# Altium schematic sheet ADF4351.SchDoc
size A4
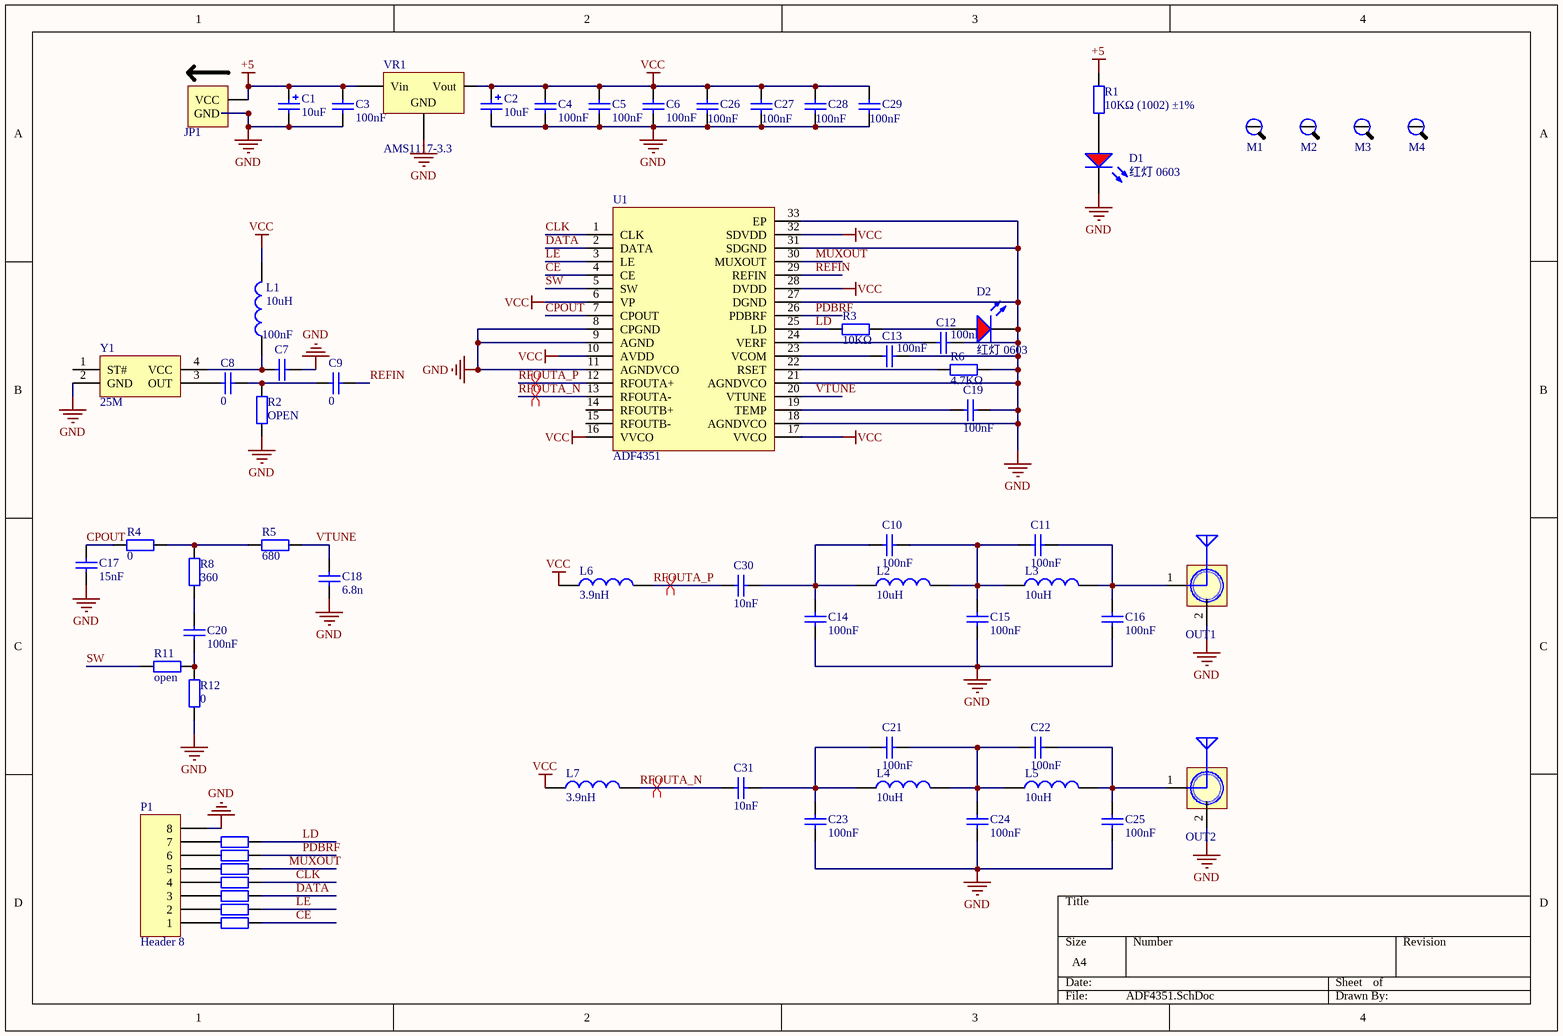
[diagram p0: ADF4351.SchDoc]

## Parts
C1  10uF  [CASE-A_3216]
C2  10uF  [CASE-A_3216]
C3  100nF  [0603_C]
C4  100nF  [0603_C]
C5  100nF  [0603_C]
C6  100nF  [0603_C]
C7  100nF  [0603_C]
C8  0  [0603_C]
C9  0  [0603_C]
C10  100nF  [0603_C]
C11  100nF  [0603_C]
C12  100nF  [0603_C]
C13  100nF  [0603_C]
C14  100nF  [0603_C]
C15  100nF  [0603_C]
C16  100nF  [0603_C]
C17  15nF  [0603_C]
C18  6.8n  [0603_C]
C19  100nF  [0603_C]
C20  100nF  [0603_C]
C21  100nF  [0603_C]
C22  100nF  [0603_C]
C23  100nF  [0603_C]
C24  100nF  [0603_C]
C25  100nF  [0603_C]
C26  100nF  [0603_C]
C27  100nF  [0603_C]
C28  100nF  [0603_C]
C29  100nF  [0603_C]
C30  10nF  [0603_C]
C31  10nF  [0603_C]
D1  红灯 0603  [0603_LED_S1]
D2  红灯 0603  [0603_LED_S1]
JP1  HDR-1X2  [Power_IN_3.81-2P]  (value not drawn)
L1  value 10uH  [L0603]  (hidden comment: IND)
L2  value 10uH  [L0603]  (hidden comment: IND)
L3  value 10uH  [L0603]  (hidden comment: IND)
L4  value 10uH  [L0603]  (hidden comment: IND)
L5  value 10uH  [L0603]  (hidden comment: IND)
L6  value 3.9nH  [L0603]  (hidden comment: IND)
L7  value 3.9nH  [L0603]  (hidden comment: IND)
M1  M3  [M3x10_L]  (value not drawn)
M2  M3  [M3x10_L]  (value not drawn)
M3  M3  [M3x10_L]  (value not drawn)
M4  M3  [M3x10_L]  (value not drawn)
OUT1  SMA WIFI 天线接口  [SMA]  (value not drawn)
OUT2  SMA WIFI 天线接口  [SMA]  (value not drawn)
P1  Header 8  [HDR1X8]
R1  10KΩ (1002) ±1%  [0603_R]
R2  OPEN  [0603_R]
R3  10KΩ  [0603_R]
R4  0  [0603_R]
R5  680  [0603_R]
R6  4.7KΩ  [0603_R]
R8  360  [0603_R]
R11  open  [0603_R]
R12  0  [0603_R]
R14  10KΩ  [0603_R]  (value not drawn)
R15  10KΩ  [0603_R]  (value not drawn)
R16  10KΩ  [0603_R]  (value not drawn)
R17  10KΩ  [0603_R]  (value not drawn)
R18  10KΩ  [0603_R]  (value not drawn)
R19  10KΩ  [0603_R]  (value not drawn)
R20  10KΩ  [0603_R]  (value not drawn)
U1  ADF4351  [LFCSP-32_L5.0-W5.0-P0.50-BL-EP3.1]
VR1  AMS1117-3.3  [SOT-223]
Y1  value 25M  [OSC 3225-4P]  (hidden comment: CRYSTAL)

## Nets
+5: C1.1 C3.2 JP1.1(VCC) R1.2 VR1.3(Vin)
GND: C1.2 C2.2 C3.1 C4.1 C5.1 C6.1 C7.1 C12.1 C13.1 C14.1 C15.1 C16.1 C17.2 C18.2 C19.1 C23.1 C24.1 C25.1 C26.1 C27.1 C28.1 C29.1 D1.K D2.K JP1.2(GND) OUT1.2 OUT2.2 P1.8 R2.2 R6.1 R12.1 U1.8(CPGND) U1.9(AGND) U1.11(AGNDVCO) U1.18(AGNDVCO) U1.21(AGNDVCO) U1.27(DGND) U1.31(SDGND) U1.33(EP) VR1.1(GND) Y1.2(GND)
VCC: C2.1 C4.2 C5.2 C6.2 C26.2 C27.2 C28.2 C29.2 L1.2 L6.1 L7.1 U1.6(VP) U1.10(AVDD) U1.16(VVCO) U1.17(VVCO) U1.28(DVDD) U1.32(SDVDD) VR1.2(Vout)
CE: R20.1 U1.4(CE)
CLK: R17.2 U1.1(CLK)
CPOUT: C17.1 R4.1 U1.7(CPOUT)
DATA: R18.1 U1.2(DATA)
LD: R3.2 R14.2 U1.25(LD)
LE: R19.1 U1.3(LE)
MUXOUT: R16.2 U1.30(MUXOUT)
PDBRF: R15.2 U1.26(PDBRF)
REFIN: C9.1 U1.29(REFIN)
RFOUTA_N: C31.2 L7.2 U1.13(RFOUTA-)
RFOUTA_P: C30.2 L6.2 U1.12(RFOUTA+)
SW: R11.1 U1.5(SW)
VTUNE: C18.1 R5.2 U1.20(VTUNE)
NetC7_2: C7.2 L1.1 Y1.4(VCC)
NetC8_1: C8.1 C9.2 R2.1
NetC8_2: C8.2 Y1.3(OUT)
NetC10_1: C10.1 C14.2 C30.1 L2.1
NetC10_2: C10.2 C11.1 C15.2 L2.2 L3.1
NetC11_2: C11.2 C16.2 L3.2 OUT1.1(SINGLE)
NetC12_2: C12.2 U1.24(VERF)
NetC13_2: C13.2 U1.23(VCOM)
NetC19_2: C19.2 U1.19(TEMP)
NetC20_1: C20.1 R8.2
NetC20_2: C20.2 R11.2 R12.2
NetC21_1: C21.1 C23.2 C31.1 L4.1
NetC21_2: C21.2 C22.1 C24.2 L4.2 L5.1
NetC22_2: C22.2 C25.2 L5.2 OUT2.1(SINGLE)
NetD1_A: D1.A R1.1
NetD2_A: D2.A R3.1
NetP1_1: P1.1 R20.2
NetP1_2: P1.2 R19.2
NetP1_3: P1.3 R18.2
NetP1_4: P1.4 R17.1
NetP1_5: P1.5 R16.1
NetP1_6: P1.6 R15.1
NetP1_7: P1.7 R14.1
NetR4_2: R4.2 R5.1 R8.1
NetR6_2: R6.2 U1.22(RSET)

Not connected (* = marked no-connect by the designer): M1 1; M2 1; M3 1; M4 1; U1 14(RFOUTB+) 15(RFOUTB-); Y1 1(ST#)

## Layout directives
differential pair: RFOUTA_N, RFOUTA_P

## Library data of the parts
C1 C2 = 3216 10uF (106) 10% 16V: 钽电容; ComponentLink1Description: 供应商链接; ComponentLink1URL: http://www.szlcsc.com/product/details_7643.html; Package: 3216; Supplier: LC; SuppliersPartNumber: C7171
C3-C31 = 0603 100nF (104) 10% 50V: 贴片电容; ComponentLink1Description: 供应商链接; ComponentLink1URL: http://www.szlcsc.com/product/details_15331.html; Package: 0603; Supplier: LC; SuppliersPartNumber: C14663
D1 D2 = 0603 红灯: 发光二极管; ComponentLink1Description: 供应商链接; ComponentLink1URL: http://www.szlcsc.com/product/details_2659.html; Package: 0603; Supplier: LC; SuppliersPartNumber: C2286
JP1 = PORT_Power_IN2: 2P接插件,模块单电源供电口; 版权归属: 源创客; BOM名称: 2P接插件; 学习资源: www.ooocke.com
L1-L7 = 0IND: 小功率贴片电感
M1-M4 = ELSE_M3_screw: 螺丝
OUT1 OUT2 = PORT_SMA: SMA-2.4G射频天线接口; 版权归属: 源创客; BOM名称: SMA-2.4G射频天线接口; 学习资源: www.ooocke.com
P1 = Header 8: Header, 8-Pin; LatestRevisionDate: 17-Jul-2002; LatestRevisionNote: Re-released for DXP Platform.; Publisher: Altium Limited
R1-R6 R8 R11 R12 R14-R20 = 0603 10KΩ (1002) 1%: 贴片电阻; ComponentLink1Description: 供应商链接; ComponentLink1URL: http://www.szlcsc.com/product/details_26547.html; Package: 0603; Supplier: LC; SuppliersPartNumber: C25804
VR1 = SOT-223 AMS1117-3.3: 低压差线性稳压(LDO); ComponentLink1Description: 供应商链接; ComponentLink1URL: http://www.szlcsc.com/product/details_6652.html; Package: SOT-223; Supplier: LC; SuppliersPartNumber: C6186
Y1 = CRYSTAL_有源晶振-25M-3225-4P